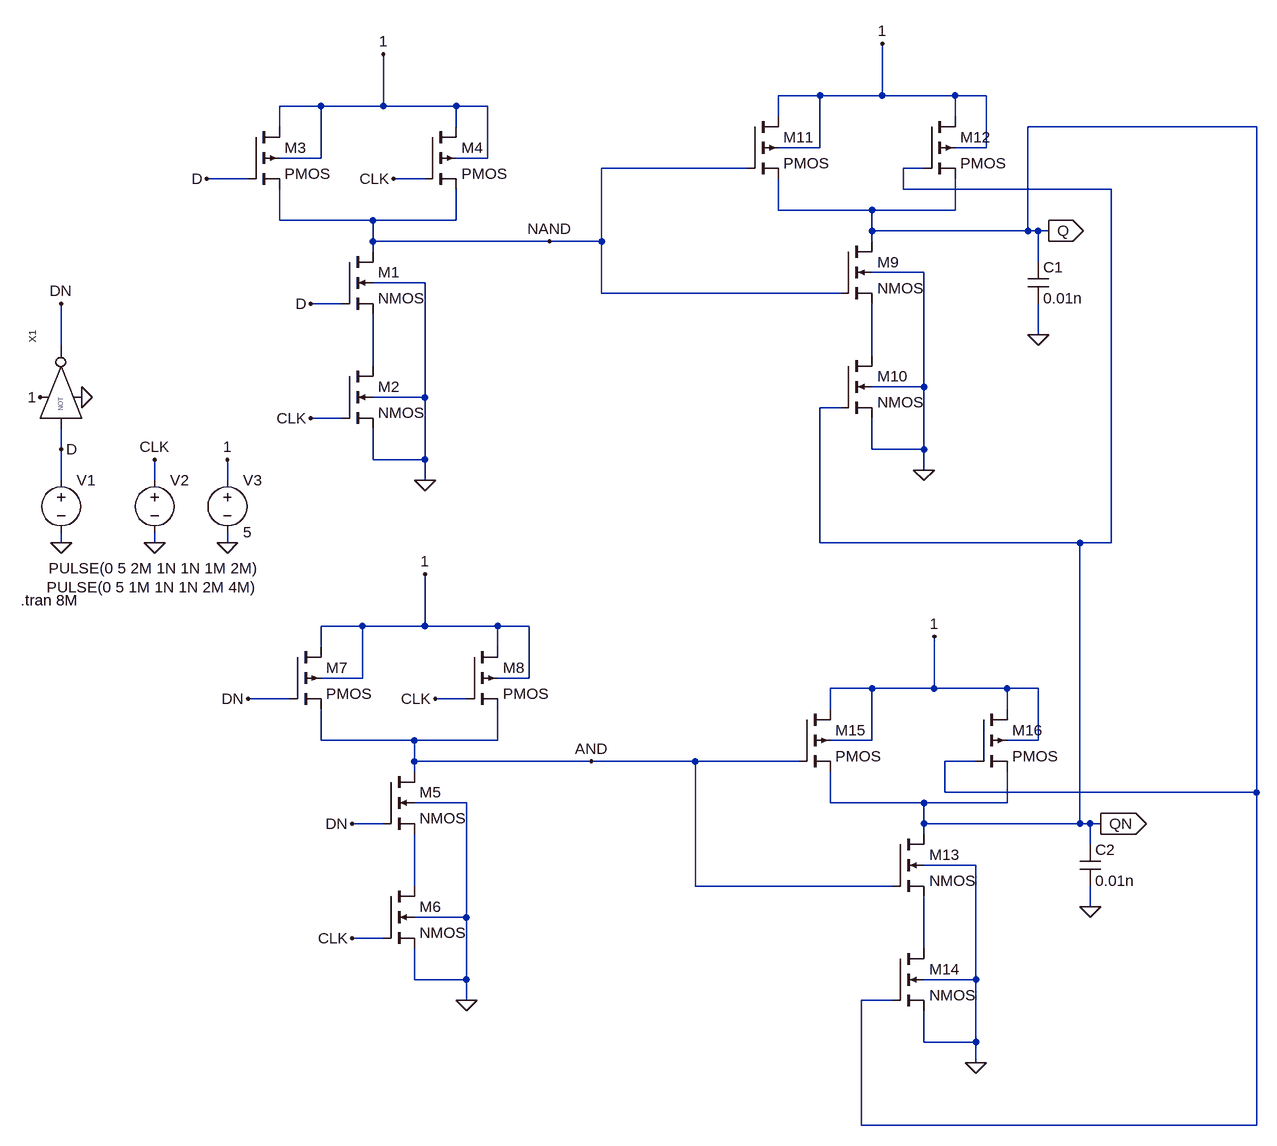
[diagram p0: schematic D_FLIPFLOP_CMOS.asc]
D_FLIPFLOP_CMOS.asc, the LTspice schematic file:
Version 4
SHEET 1 2760 1556
WIRE 2080 -32 2016 -32
WIRE 2176 -32 2176 -112
WIRE 2176 -32 2080 -32
WIRE 2288 -32 2176 -32
WIRE 2336 -32 2288 -32
WIRE 1312 -16 1248 -16
WIRE 1408 -16 1408 -96
WIRE 1408 -16 1312 -16
WIRE 1520 -16 1408 -16
WIRE 1568 -16 1520 -16
WIRE 2016 0 2016 -32
WIRE 2288 0 2288 -32
WIRE 1248 16 1248 -16
WIRE 1520 16 1520 -16
WIRE 2752 16 2400 16
WIRE 2080 48 2080 -32
WIRE 2080 48 2016 48
WIRE 2336 48 2336 -32
WIRE 2336 48 2288 48
WIRE 1312 64 1312 -16
WIRE 1312 64 1248 64
WIRE 1568 64 1568 -16
WIRE 1568 64 1520 64
WIRE 1968 80 1744 80
WIRE 2240 80 2208 80
WIRE 1200 96 1136 96
WIRE 1472 96 1424 96
WIRE 2208 112 2208 80
WIRE 2528 112 2208 112
WIRE 2016 144 2016 96
WIRE 2160 144 2016 144
WIRE 2288 144 2288 96
WIRE 2288 144 2160 144
WIRE 1248 160 1248 112
WIRE 1392 160 1248 160
WIRE 1520 160 1520 112
WIRE 1520 160 1392 160
WIRE 2160 176 2160 144
WIRE 2400 176 2400 16
WIRE 2400 176 2160 176
WIRE 2416 176 2400 176
WIRE 2432 176 2416 176
WIRE 1392 192 1392 160
WIRE 1664 192 1392 192
WIRE 1744 192 1744 80
WIRE 1744 192 1664 192
WIRE 2160 192 2160 176
WIRE 1392 208 1392 192
WIRE 2416 224 2416 176
WIRE 2240 240 2160 240
WIRE 1472 256 1392 256
WIRE 1744 272 1744 192
WIRE 2112 272 1744 272
WIRE 1344 288 1296 288
WIRE 2416 336 2416 288
WIRE 912 352 912 288
WIRE 2160 368 2160 288
WIRE 1392 384 1392 304
WIRE 2240 416 2240 240
WIRE 2240 416 2160 416
WIRE 1472 432 1472 256
WIRE 1472 432 1392 432
WIRE 2112 448 2080 448
WIRE 1344 464 1296 464
WIRE 912 512 912 480
WIRE 2160 512 2160 464
WIRE 2240 512 2240 416
WIRE 2240 512 2160 512
WIRE 1392 528 1392 480
WIRE 1472 528 1472 432
WIRE 1472 528 1392 528
WIRE 2240 544 2240 512
WIRE 912 560 912 512
WIRE 1056 560 1056 528
WIRE 1168 560 1168 528
WIRE 1472 560 1472 528
WIRE 912 656 912 640
WIRE 1056 656 1056 640
WIRE 1168 656 1168 640
WIRE 2080 656 2080 448
WIRE 2480 656 2080 656
WIRE 2528 656 2528 112
WIRE 2528 656 2480 656
WIRE 1376 784 1312 784
WIRE 1472 784 1472 704
WIRE 1472 784 1376 784
WIRE 1584 784 1472 784
WIRE 1632 784 1584 784
WIRE 1312 816 1312 784
WIRE 1584 816 1584 784
WIRE 1376 864 1376 784
WIRE 1376 864 1312 864
WIRE 1632 864 1632 784
WIRE 1632 864 1584 864
WIRE 2160 880 2096 880
WIRE 2256 880 2256 800
WIRE 2256 880 2160 880
WIRE 2368 880 2256 880
WIRE 2416 880 2368 880
WIRE 1264 896 1200 896
WIRE 1536 896 1488 896
WIRE 2096 912 2096 880
WIRE 2368 912 2368 880
WIRE 1312 960 1312 912
WIRE 1456 960 1312 960
WIRE 1584 960 1584 912
WIRE 1584 960 1456 960
WIRE 2160 960 2160 880
WIRE 2160 960 2096 960
WIRE 2416 960 2416 880
WIRE 2416 960 2368 960
WIRE 1456 992 1456 960
WIRE 1728 992 1456 992
WIRE 1888 992 1728 992
WIRE 2048 992 1888 992
WIRE 2320 992 2272 992
WIRE 1456 1008 1456 992
WIRE 2272 1040 2272 992
WIRE 2752 1040 2752 16
WIRE 2752 1040 2272 1040
WIRE 1536 1056 1456 1056
WIRE 2096 1056 2096 1008
WIRE 2240 1056 2096 1056
WIRE 2368 1056 2368 1008
WIRE 2368 1056 2240 1056
WIRE 1408 1088 1360 1088
WIRE 2240 1088 2240 1056
WIRE 2480 1088 2480 656
WIRE 2480 1088 2240 1088
WIRE 2496 1088 2480 1088
WIRE 2512 1088 2496 1088
WIRE 2240 1104 2240 1088
WIRE 2496 1120 2496 1088
WIRE 2320 1152 2240 1152
WIRE 1456 1184 1456 1104
WIRE 1888 1184 1888 992
WIRE 2192 1184 1888 1184
WIRE 2496 1216 2496 1184
WIRE 1536 1232 1536 1056
WIRE 1536 1232 1456 1232
WIRE 1408 1264 1360 1264
WIRE 2240 1280 2240 1200
WIRE 1456 1328 1456 1280
WIRE 1536 1328 1536 1232
WIRE 1536 1328 1456 1328
WIRE 2320 1328 2320 1152
WIRE 2320 1328 2240 1328
WIRE 1536 1360 1536 1328
WIRE 2192 1360 2144 1360
WIRE 2240 1424 2240 1376
WIRE 2320 1424 2320 1328
WIRE 2320 1424 2240 1424
WIRE 2320 1456 2320 1424
WIRE 2144 1552 2144 1360
WIRE 2752 1552 2752 1040
WIRE 2752 1552 2144 1552
FLAG 1168 528 1
FLAG 1056 528 CLK
FLAG 912 288 DN
FLAG 880 432 1
FLAG 912 512 D
FLAG 944 432 0
FLAG 1056 656 0
FLAG 1168 656 0
FLAG 912 656 0
FLAG 1408 -96 1
FLAG 1424 96 CLK
FLAG 1136 96 D
FLAG 1296 288 D
FLAG 1296 464 CLK
FLAG 1664 192 NAND
FLAG 1472 560 0
FLAG 1472 704 1
FLAG 1488 896 CLK
FLAG 1200 896 DN
FLAG 1360 1088 DN
FLAG 1360 1264 CLK
FLAG 1728 992 AND
FLAG 1536 1360 0
FLAG 2176 -112 1
FLAG 2432 176 Q
IOPIN 2432 176 Out
FLAG 2240 544 0
FLAG 2256 800 1
FLAG 2512 1088 QN
IOPIN 2512 1088 Out
FLAG 2320 1456 0
FLAG 2416 336 0
FLAG 2496 1216 0
SYMBOL NOT4 928 416 R270
SYMATTR InstName X1
SYMBOL voltage 912 544 R0
WINDOW 3 -19 151 Left 2
WINDOW 123 0 0 Left 0
WINDOW 39 0 0 Left 0
SYMATTR InstName V1
SYMATTR Value PULSE(0 5 2M 1N 1N 1M 2M)
SYMBOL voltage 1056 544 R0
WINDOW 3 -166 180 Left 2
WINDOW 123 0 0 Left 0
WINDOW 39 0 0 Left 0
SYMATTR InstName V2
SYMATTR Value PULSE(0 5 1M 1N 1N 2M 4M)
SYMBOL voltage 1168 544 R0
WINDOW 123 0 0 Left 0
WINDOW 39 0 0 Left 0
SYMATTR InstName V3
SYMATTR Value 5
SYMBOL nmos4 1344 208 R0
SYMATTR InstName M1
SYMBOL nmos4 1344 384 R0
SYMATTR InstName M2
SYMBOL pmos4 1200 16 R0
SYMATTR InstName M3
SYMBOL pmos4 1472 16 R0
SYMATTR InstName M4
SYMBOL nmos4 1408 1008 R0
SYMATTR InstName M5
SYMBOL nmos4 1408 1184 R0
SYMATTR InstName M6
SYMBOL pmos4 1264 816 R0
SYMATTR InstName M7
SYMBOL pmos4 1536 816 R0
SYMATTR InstName M8
SYMBOL nmos4 2112 192 R0
SYMATTR InstName M9
SYMBOL nmos4 2112 368 R0
SYMATTR InstName M10
SYMBOL pmos4 1968 0 R0
SYMATTR InstName M11
SYMBOL pmos4 2240 0 R0
SYMATTR InstName M12
SYMBOL nmos4 2192 1104 R0
SYMATTR InstName M13
SYMBOL nmos4 2192 1280 R0
SYMATTR InstName M14
SYMBOL pmos4 2048 912 R0
SYMATTR InstName M15
SYMBOL pmos4 2320 912 R0
SYMATTR InstName M16
SYMBOL cap 2400 224 R0
SYMATTR InstName C1
SYMATTR Value 0.01n
SYMBOL cap 2480 1120 R0
SYMATTR InstName C2
SYMATTR Value 0.01n
TEXT 850 744 Left 2 !.tran 8M

The netlist it stands for:
* D_FLIPFLOP_CMOS.asc
XX1 D 1 0 DN NOT4  ; pins A VH VL OUT
V1 D 0 PULSE(0 5 2M 1N 1N 1M 2M)
V2 CLK 0 PULSE(0 5 1M 1N 1N 2M 4M)
V3 1 0 5
M1 NAND D N002 0 NMOS
M2 N002 CLK 0 0 NMOS
M3 1 D NAND 1 PMOS
M4 1 CLK NAND 1 PMOS
M5 AND DN N003 0 NMOS
M6 N003 CLK 0 0 NMOS
M7 1 DN AND 1 PMOS
M8 1 CLK AND 1 PMOS
M9 Q NAND N001 0 NMOS
M10 N001 QN 0 0 NMOS
M11 1 NAND Q 1 PMOS
M12 1 QN Q 1 PMOS
M13 QN AND N004 0 NMOS
M14 N004 Q 0 0 NMOS
M15 1 AND QN 1 PMOS
M16 1 Q QN 1 PMOS
C1 Q 0 0.01n
C2 QN 0 0.01n
.model NMOS NMOS
.model PMOS PMOS
.lib standard.mos
.tran 8M
.backanno
.end

* Results of the author's LTspice run, read from the files saved beside the schematic
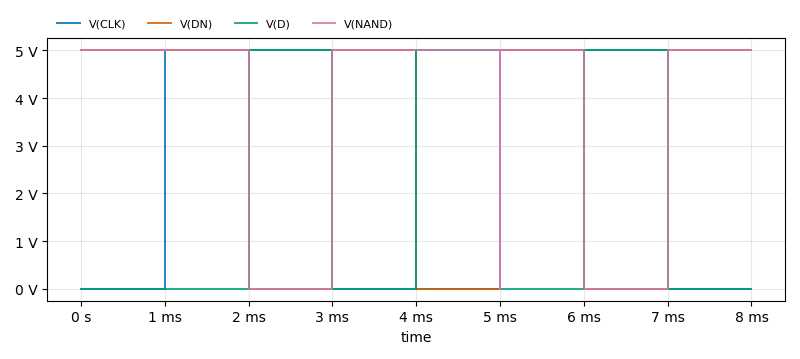
[diagram p1: Transient Analysis of D_FLIPFLOP_CMOS.asc, plotted from the saved traces]
* Transient Analysis, 1 run:
*   V(CLK): min 0 V, max 5 V, average 2.5 V, rms 3.536 V, last 0 V
*   V(DN): min 0 V, max 5 V, average 3.125 V, rms 3.953 V, last 5 V
*   V(D): min 0 V, max 5 V, average 1.875 V, rms 3.062 V, last 0 V
*   V(NAND): min 0 V, max 5 V, average 3.75 V, rms 4.33 V, last 5 V